# EAGLE design Umwandlung 1.8 to 5 V2 (EAGLE 6.4)
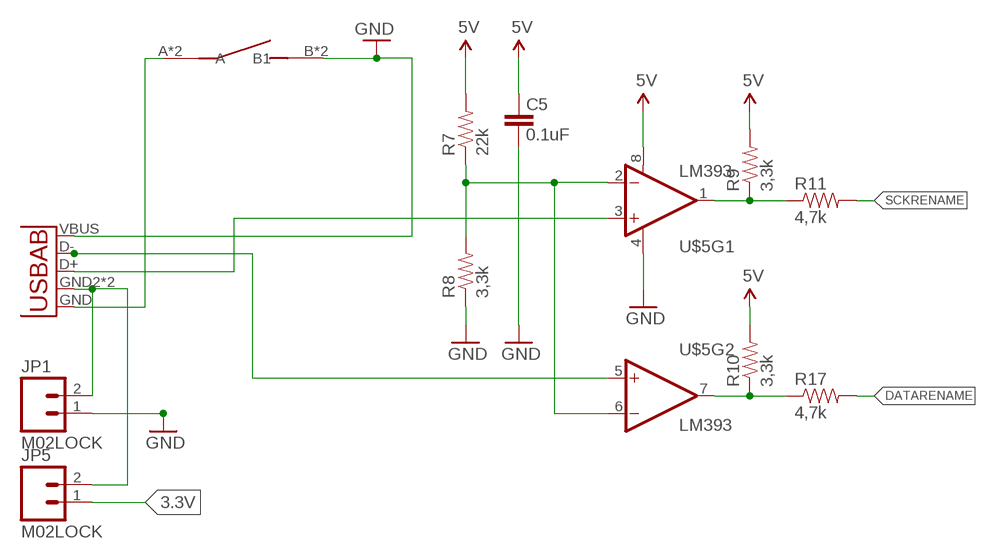
[diagram p0: schematic, sheet 1]

## Parts
C5  0.1uF  CAP0805  [0805]
JP1  M02LOCK  [1X02_LOCK]
JP5  M02LOCK  [1X02_LOCK]
R7  22k  RESISTOR  [0805]
R8  3,3k  RESISTOR  [0805]
R9  3,3k  RESISTOR  [0805]
R10  3,3k  RESISTOR  [0805]
R11  4,7k  RESISTOR  [0805]
R17  4,7k  RESISTOR  [0805]
U$1  TASTE_R3FTL6  [TASTE_R3FTL6]
U$5  LM393  [SO08]
U$7  USB-A  [USB-A]

## Nets
3.3V: JP5.1
5V: C5.2 R7.2 R9.2 R10.2 U$5.8(V+)
DATA1: R9.1 R11.1 U$5.1(OUT)
DATARENAME: R17.2
GND [vcc]: C5.1 JP1.1 R8.1 U$1.B1 U$1.B(B1) U$5.4(V-) U$7.VBUS
N$1: U$1.A U$1.A1(A) U$7.GND
N$9: R7.1 R8.2 U$5.2(-IN) U$5.6(-IN)
N$10: U$5.3(+IN) U$7.D+
N$11: U$5.5(+IN) U$7.D-
N$15: JP1.2 JP5.2 U$7.GND2(USBID) U$7.GND3(USBID)
SCK1: R10.1 R17.1 U$5.7(OUT)
SCKRENAME: R11.2

## Library data of the parts
C5 = SparkFun:CAP: Capacitor Standard 0603 ceramic capacitor, and 0.1" leaded capacitor.
JP1 JP5 = SparkFun-Connectors:M02: Standard 2-pin 0.1" header. Use with - straight break away headers ( PRT-00116) - right angle break away headers (PRT-00553) - swiss pins (PRT-00743) - machine pins (PRT-00117) - female headers (PRT-00115) Molex polarized connector foot print use with: PRT-08233 with associated crimp pins and housings. 2.54_SCREWTERM for use with PRT-10571. 3.5mm Screw Terminal footprints for PRT-08084 5mm Screw Terminal footprints for use with PRT-08433
R7-R11 R17 = SparkFun:RESISTOR: Resistor Basic schematic elements and footprints for 0603, 1206, and PTH 1/10th watt (small) resistors.
U$1 = andi:TASTE_R3FTL6: http://www.reichelt.de/Kurzhubtaster/TASTER-3FTL6/3/index.html?&ACTION=3&LA=2&ARTICLE=79697&GROUPID=3278&artnr=TASTER+3FTL6
U$5 = SparkFun-AnalogIC:LM393: Low-voltage comparator
U$7 = andi:USB-A

## Net classes
0 default: width 0.203 mm, clearance 0.205 mm
1 vcc: width 0.254 mm, clearance 0.205 mm to class 0, clearance 0.205 mm

## Board
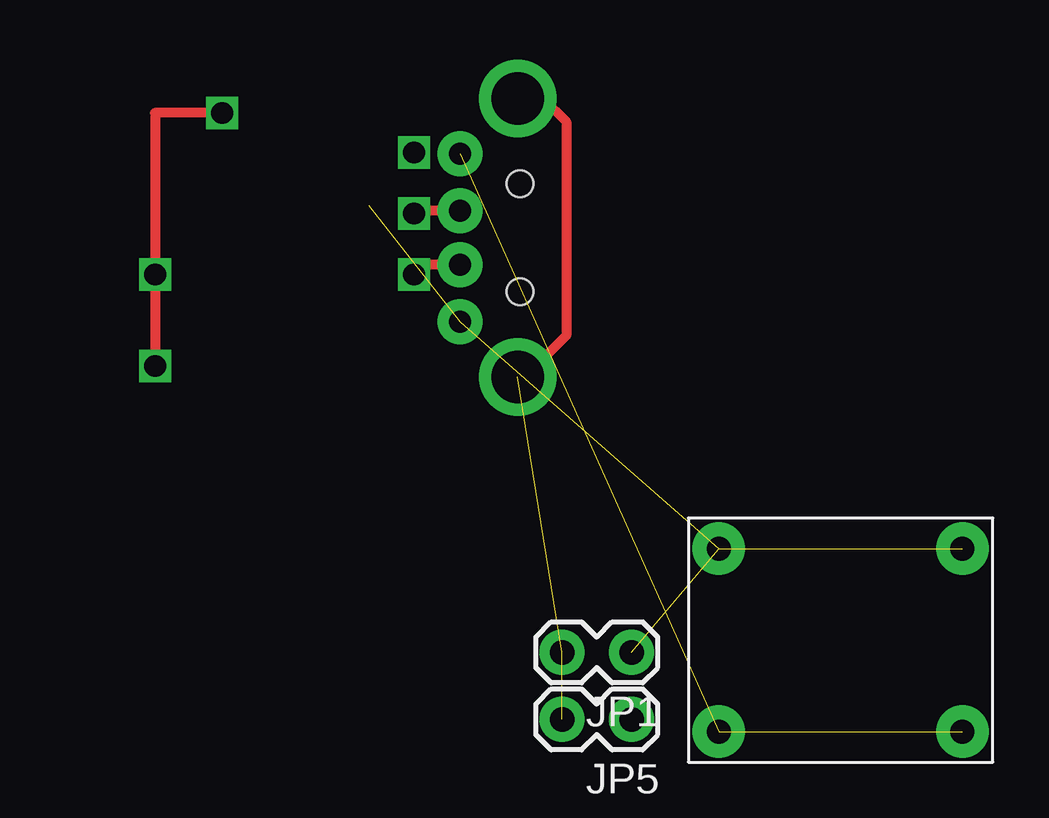
[diagram p1: board, top side]
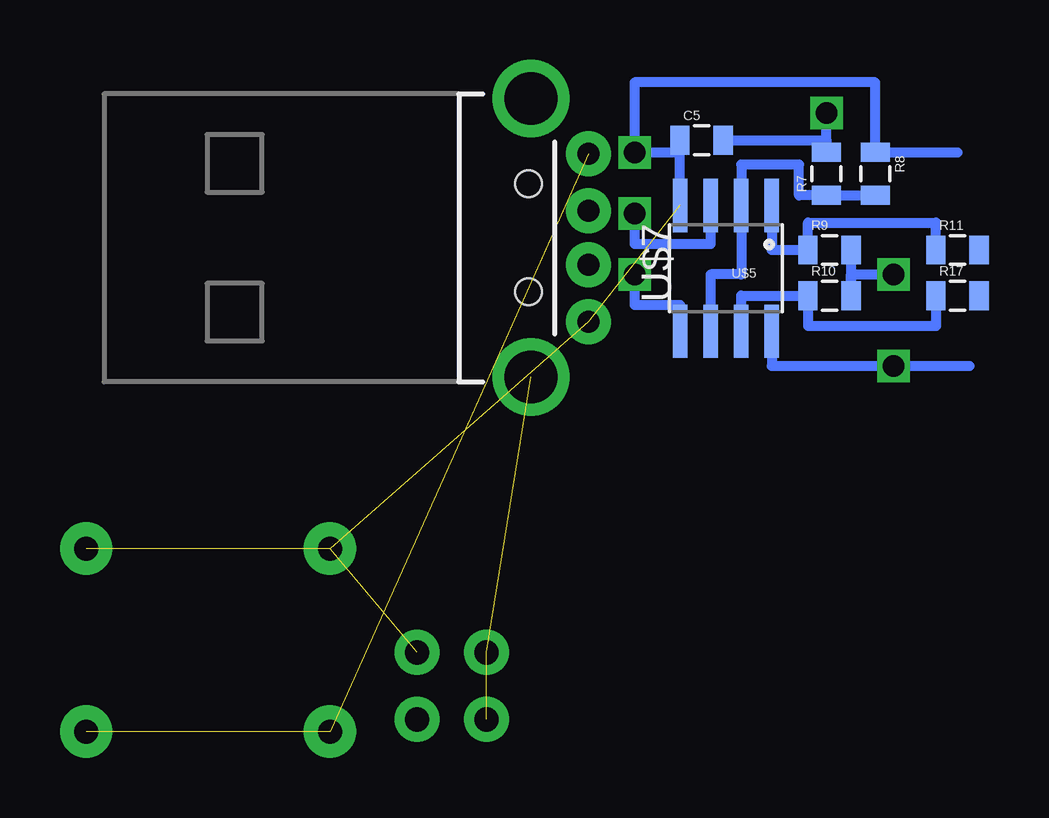
[diagram p2: board, bottom side, seen from below]

No outline drawn. Coordinates in mm, seen from the top.
Copper layers (1*16): Top 0.035mm / dielectric 1.5mm / Bottom 0.035mm
Design rules "default": minimum track width 10mil, minimum drill 24mil, track to track 8mil, track to pad 8mil, pad to pad 8mil, via to via 8mil, smd to smd 8mil, copper to edge 40mil, drill to drill 8mil, minimum pad ring 10mil, minimum via ring 8mil, stop-mask expansion 4mil, vias tented up to drill 0mil, thermal gap 10mil

### Footprints (pad centres in the part's own frame; a part is rotated, then mirrored left to right if it is on the bottom)
0805 = smd 0.8 x 1.2: 1 -0.9,0; 2 0.9,0
1X02_LOCK = drill 1.016 pad 1.88: 1 -0.178,0; 2 2.718,0
TASTE_R3FTL6 = drill 1 pad 2.184: A -1.27,0; A1 8.89,0; B 8.89,7.62; B1 -1.27,7.62
SO08 = smd 0.61 x 2.21: 1 -1.905,-2.616; 2 -0.635,-2.616; 3 0.635,-2.616; 4 1.905,-2.616; 5 1.905,2.616; 6 0.635,2.616; 7 -0.635,2.616; 8 -1.905,2.616
USB-A = drill 0.914 pad 1.88: D+ 10.02,1.127; D- 10.02,-1.127; GND 10.02,3.5; VBUS 10.02,-3.5 | drill 2.2: GND2 7.62,-5.8; GND3 7.62,5.8 | hole 1.1: 7.52,2.25; 7.52,-2.25

### Placement (x,y rotation side)
C5  65.79,36.07 0 bottom
JP1  77.47,14.73 180 top
JP5  77.47,11.94 180 top
R7  60.58,34.67 90 bottom
R8  58.55,34.67 270 bottom
R9  60.45,31.5 0 bottom
R10  60.45,29.59 0 bottom
R11  55.12,31.5 0 bottom
R17  55.12,29.59 0 bottom
U$1  82.55,11.43 0 top
U$5  64.77,30.73 180 bottom
U$7  80.52,32 0 bottom

### Tracks (layer width: path | path; a pad name or v marks a point on that pad's centre or on a via)
5V  (via drill 0.9)
  Top 0.406: v57.78,26.67 v57.78,30.48 57.78,37.21 v60.58,37.21
  Bottom 0.406: R9.2 R10.2 59.55,29.21 59.56,29.21 59.56,30.48 v57.78,30.48 | C5.2 60.58,36.07 R7.2 v60.58,37.21 | U$5.8 62.87,26.67 v57.78,26.67 54.61,26.67
DATA1
  Bottom 0.406: U$5.1 62.87,31.5 R9.1 61.35,32.64 56.02,32.64 R11.1
GND  (via drill 0.9)  (4 unrouted)
  Top 0.406: 68.58,35.5 v68.58,35.56
  Bottom 0.406: 66.69,35.56 v68.58,35.56 68.58,38.48 58.55,38.48 R8.1 55.12,35.56 | 66.69,35.56 C5.1 | U$5.4 66.69,33.35 66.69,35.56
N$1  (2 unrouted)
N$9
  Bottom 0.406: R8.2 R7.1 61.72,33.77 61.72,35.05 64.14,35.05 U$5.2 64.14,30.48 65.41,30.48 U$5.6
N$10  (via drill 0.9)
  Top 0.406: U$7.D+ 68.58,33.13 v68.58,33.02
  Bottom 0.406: v68.58,33.02 68.58,31.75 65.41,31.75 U$5.3
N$11  (via drill 0.9)
  Top 0.406: U$7.D- 68.58,30.88 v68.58,30.48
  Bottom 0.406: v68.58,30.48 68.58,29.21 66.67,29.21 U$5.5
N$15  (2 unrouted)
  Top 0.406: U$7.GND3 73.96,37.8 74.93,36.83 74.93,27.94 73.19,26.2 U$7.GND2
SCK1
  Bottom 0.406: U$5.7 64.14,29.59 R10.1 61.35,28.32 56.02,28.32 R17.1